# EAGLE schematic colorCube64_led1 (EAGLE 7.6.0)

## Sheet 1 of 2
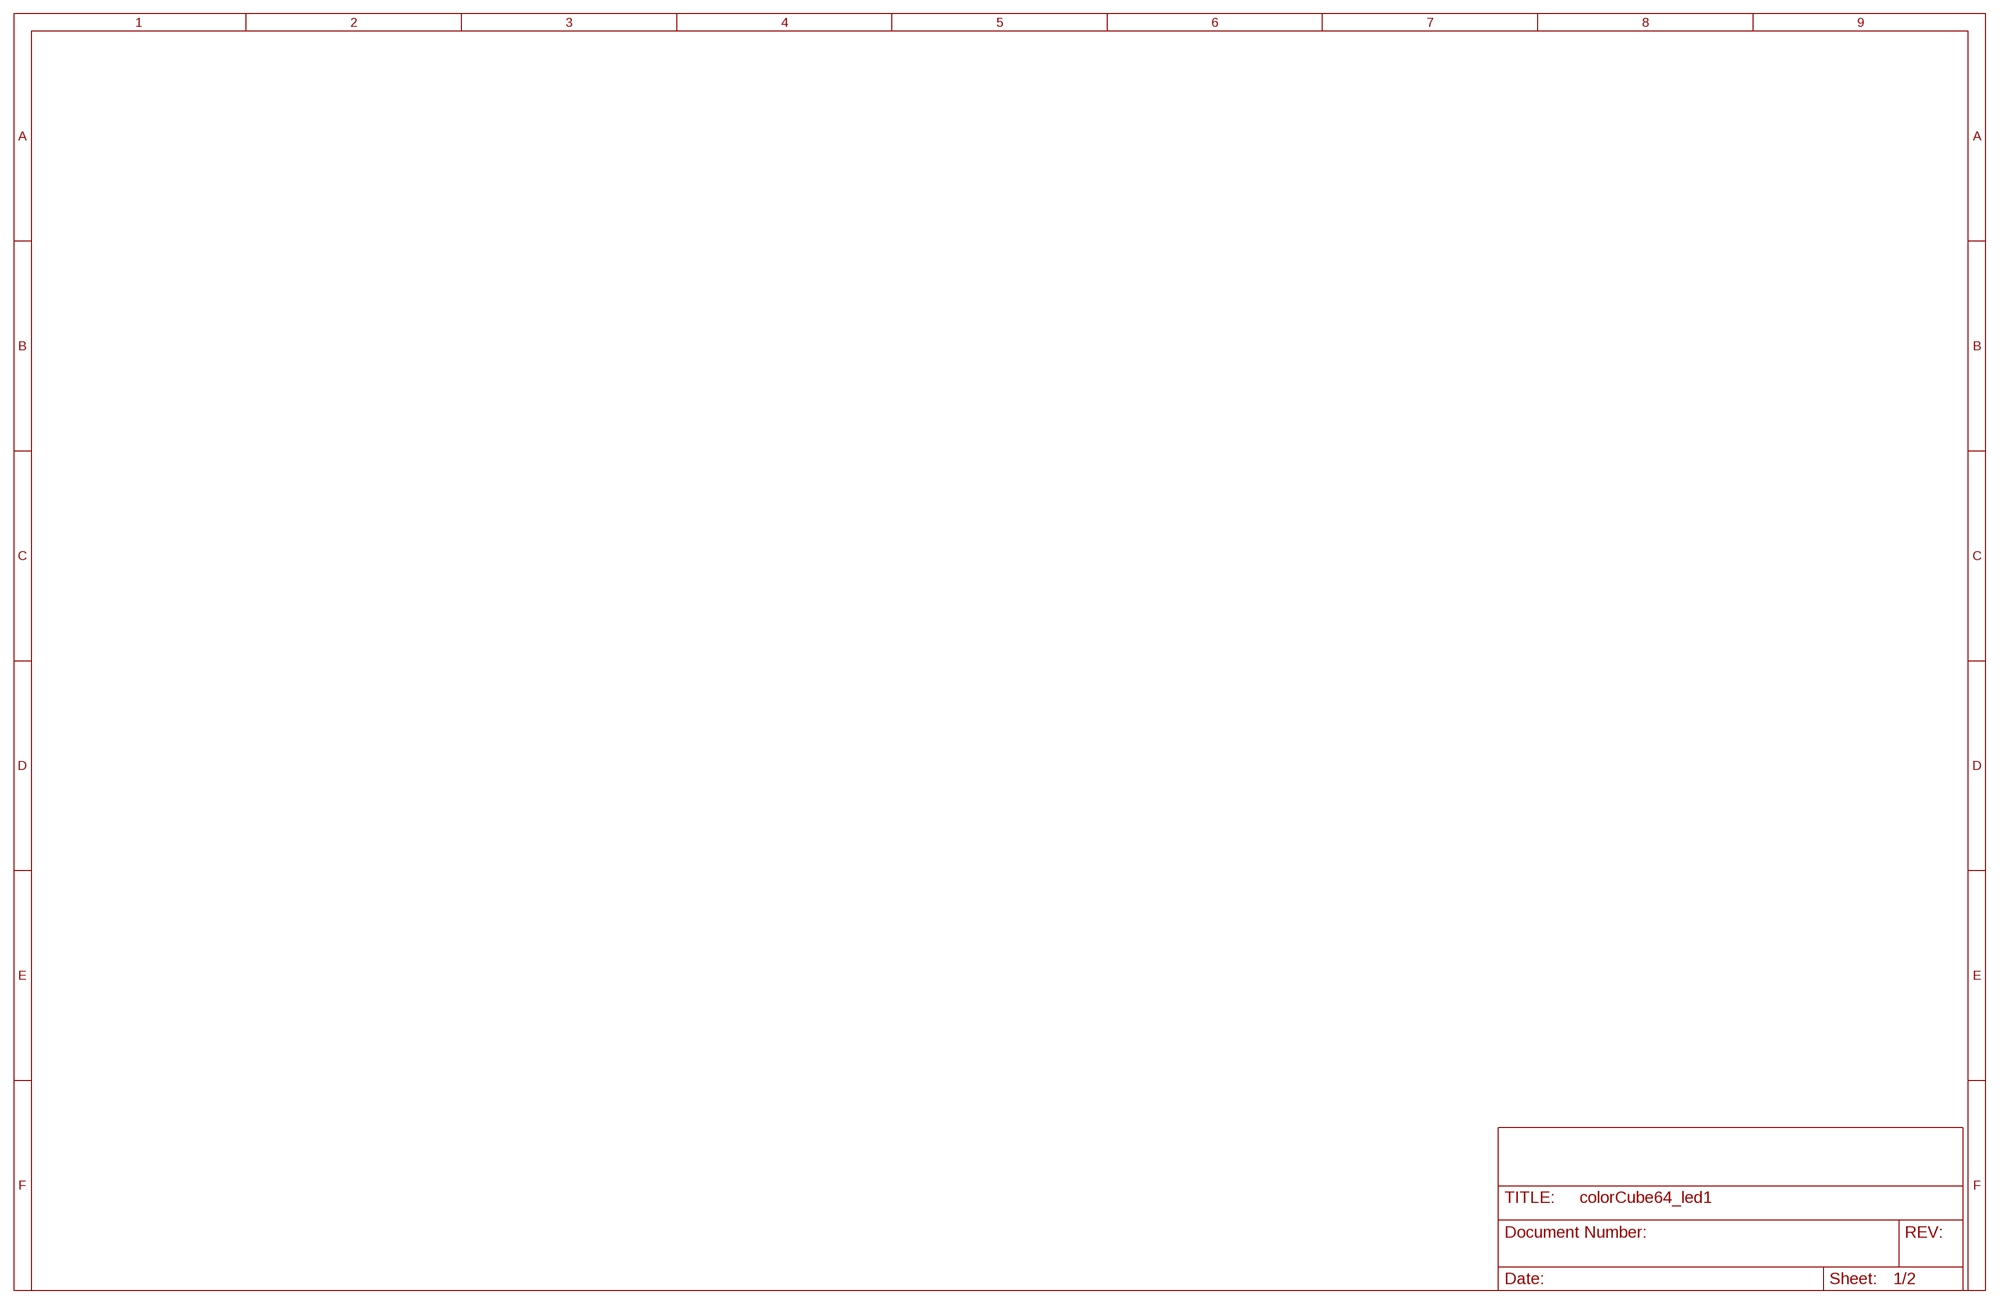
[diagram p0: schematic, sheet 1]

## Sheet 2 of 2
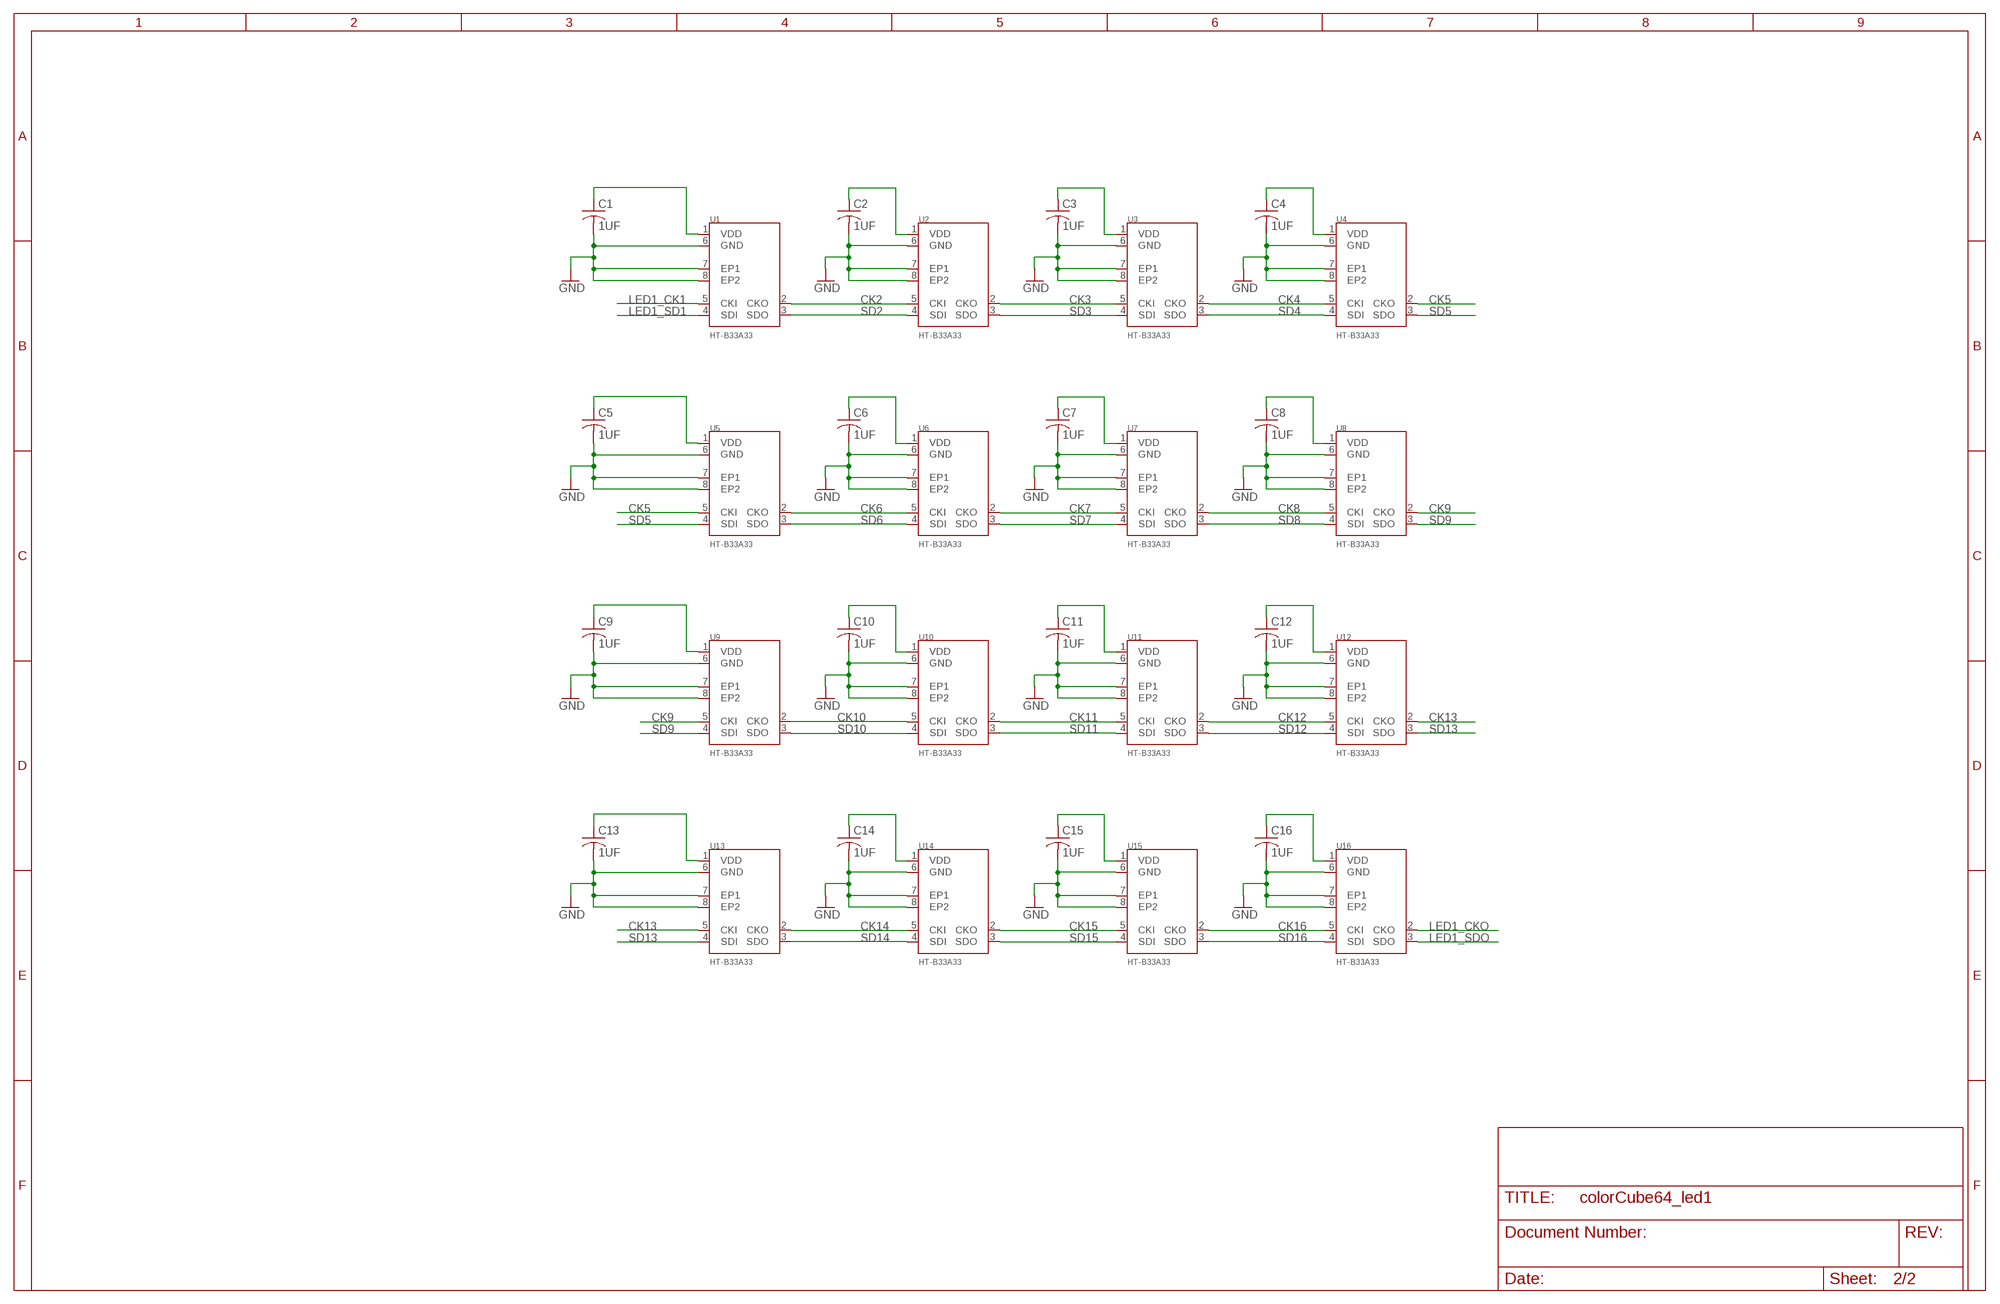
[diagram p1: schematic, sheet 2]

### Parts
C1  1UF  C-USC0201  [C0201]
C2  1UF  C-USC0201  [C0201]
C3  1UF  C-USC0201  [C0201]
C4  1UF  C-USC0201  [C0201]
C5  1UF  C-USC0201  [C0201]
C6  1UF  C-USC0201  [C0201]
C7  1UF  C-USC0201  [C0201]
C8  1UF  C-USC0201  [C0201]
C9  1UF  C-USC0201  [C0201]
C10  1UF  C-USC0201  [C0201]
C11  1UF  C-USC0201  [C0201]
C12  1UF  C-USC0201  [C0201]
C13  1UF  C-USC0201  [C0201]
C14  1UF  C-USC0201  [C0201]
C15  1UF  C-USC0201  [C0201]
C16  1UF  C-USC0201  [C0201]
U1  HT-B33A33  [HT-B33A3]
U2  HT-B33A33  [HT-B33A3]
U3  HT-B33A33  [HT-B33A3]
U4  HT-B33A33  [HT-B33A3]
U5  HT-B33A33  [HT-B33A3]
U6  HT-B33A33  [HT-B33A3]
U7  HT-B33A33  [HT-B33A3]
U8  HT-B33A33  [HT-B33A3]
U9  HT-B33A33  [HT-B33A3]
U10  HT-B33A33  [HT-B33A3]
U11  HT-B33A33  [HT-B33A3]
U12  HT-B33A33  [HT-B33A3]
U13  HT-B33A33  [HT-B33A3]
U14  HT-B33A33  [HT-B33A3]
U15  HT-B33A33  [HT-B33A3]
U16  HT-B33A33  [HT-B33A3]

### Nets
CK2: U1.2(CKO) U2.5(CKI)
CK3: U2.2(CKO) U3.5(CKI)
CK4: U3.2(CKO) U4.5(CKI)
CK5: U4.2(CKO) U5.5(CKI)
CK6: U5.2(CKO) U6.5(CKI)
CK7: U6.2(CKO) U7.5(CKI)
CK8: U7.2(CKO) U8.5(CKI)
CK9: U8.2(CKO) U9.5(CKI)
CK10: U9.2(CKO) U10.5(CKI)
CK11: U10.2(CKO) U11.5(CKI)
CK12: U11.2(CKO) U12.5(CKI)
CK13: U12.2(CKO) U13.5(CKI)
CK14: U13.2(CKO) U14.5(CKI)
CK15: U14.2(CKO) U15.5(CKI)
CK16: U15.2(CKO) U16.5(CKI)
GND: C1.2 C2.2 C3.2 C4.2 C5.2 C6.2 C7.2 C8.2 C9.2 C10.2 C11.2 C12.2 C13.2 C14.2 C15.2 C16.2 U1.6(GND) U1.7(EP1) U1.8(EP2) U2.6(GND) U2.7(EP1) U2.8(EP2) U3.6(GND) U3.7(EP1) U3.8(EP2) U4.6(GND) U4.7(EP1) U4.8(EP2) U5.6(GND) U5.7(EP1) U5.8(EP2) U6.6(GND) U6.7(EP1) U6.8(EP2) U7.6(GND) U7.7(EP1) U7.8(EP2) U8.6(GND) U8.7(EP1) U8.8(EP2) U9.6(GND) U9.7(EP1) U9.8(EP2) U10.6(GND) U10.7(EP1) U10.8(EP2) U11.6(GND) U11.7(EP1) U11.8(EP2) U12.6(GND) U12.7(EP1) U12.8(EP2) U13.6(GND) U13.7(EP1) U13.8(EP2) U14.6(GND) U14.7(EP1) U14.8(EP2) U15.6(GND) U15.7(EP1) U15.8(EP2) U16.6(GND) U16.7(EP1) U16.8(EP2)
LED1_CK1: U1.5(CKI)
LED1_CKO: U16.2(CKO)
LED1_SD1: U1.4(SDI)
LED1_SDO: U16.3(SDO)
N$1: C2.1 U2.1(VDD)
N$2: C3.1 U3.1(VDD)
N$3: C4.1 U4.1(VDD)
N$4: C5.1 U5.1(VDD)
N$5: C6.1 U6.1(VDD)
N$6: C7.1 U7.1(VDD)
N$7: C8.1 U8.1(VDD)
N$8: C9.1 U9.1(VDD)
N$9: C10.1 U10.1(VDD)
N$10: C11.1 U11.1(VDD)
N$11: C12.1 U12.1(VDD)
N$12: C13.1 U13.1(VDD)
N$13: C14.1 U14.1(VDD)
N$14: C15.1 U15.1(VDD)
N$15: C16.1 U16.1(VDD)
N$17: C1.1 U1.1(VDD)
SD2: U1.3(SDO) U2.4(SDI)
SD3: U2.3(SDO) U3.4(SDI)
SD4: U3.3(SDO) U4.4(SDI)
SD5: U4.3(SDO) U5.4(SDI)
SD6: U5.3(SDO) U6.4(SDI)
SD7: U6.3(SDO) U7.4(SDI)
SD8: U7.3(SDO) U8.4(SDI)
SD9: U8.3(SDO) U9.4(SDI)
SD10: U9.3(SDO) U10.4(SDI)
SD11: U10.3(SDO) U11.4(SDI)
SD12: U11.3(SDO) U12.4(SDI)
SD13: U12.3(SDO) U13.4(SDI)
SD14: U13.3(SDO) U14.4(SDI)
SD15: U14.3(SDO) U15.4(SDI)
SD16: U15.3(SDO) U16.4(SDI)

## Library data of the parts
C1-C16 = rcl:C-US: CAPACITOR, American symbol
U1-U16 = colorCube:HT-B33A33